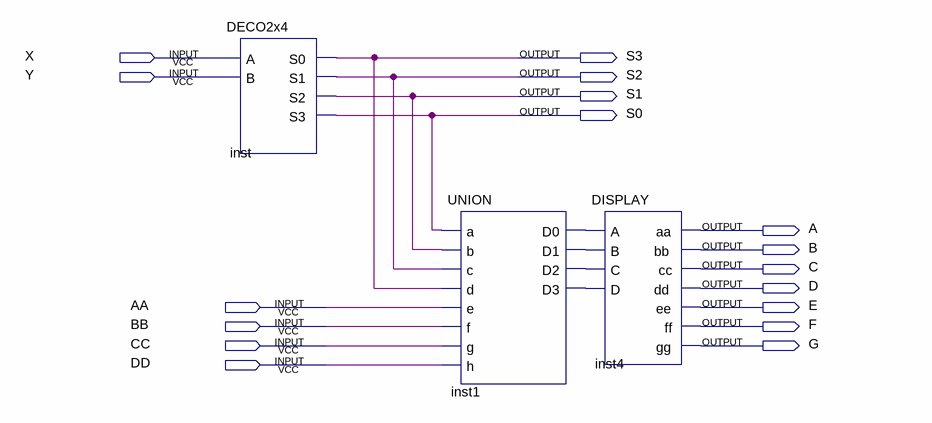
[diagram p0: schematic sheet]
// Quartus schematic PRUEBA.bdf as structural Verilog: 3 symbols, 17 pins
module PRUEBA (
  input  X,
  input  Y,
  input  AA,
  input  BB,
  input  CC,
  input  DD,
  output S3,
  output S2,
  output S1,
  output S0,
  output A,
  output B,
  output C,
  output D,
  output E,
  output F,
  output G
);

  wire inst1_d0, inst1_d1, inst1_d2, inst1_d3;

  DECO2x4 inst (.A(X), .B(Y), .S0(S3), .S1(S2), .S2(S1), .S3(S0));
  UNION inst1 (
    .a(S0), .b(S1), .c(S2), .d(S3), .e(AA), .f(BB), .g(CC), .h(DD), .D0(inst1_d0), .D1(inst1_d1),
    .D2(inst1_d2), .D3(inst1_d3));
  DISPLAY inst4 (
    .A(inst1_d0), .B(inst1_d1), .C(inst1_d2), .D(inst1_d3), .aa(A), .bb(B), .cc(C), .dd(D), .ee(E), .ff(F),
    .gg(G));
endmodule
